# Altium schematic sheet Main.SchDoc
size A4; SheetNumber: 1; SheetTotal: 5
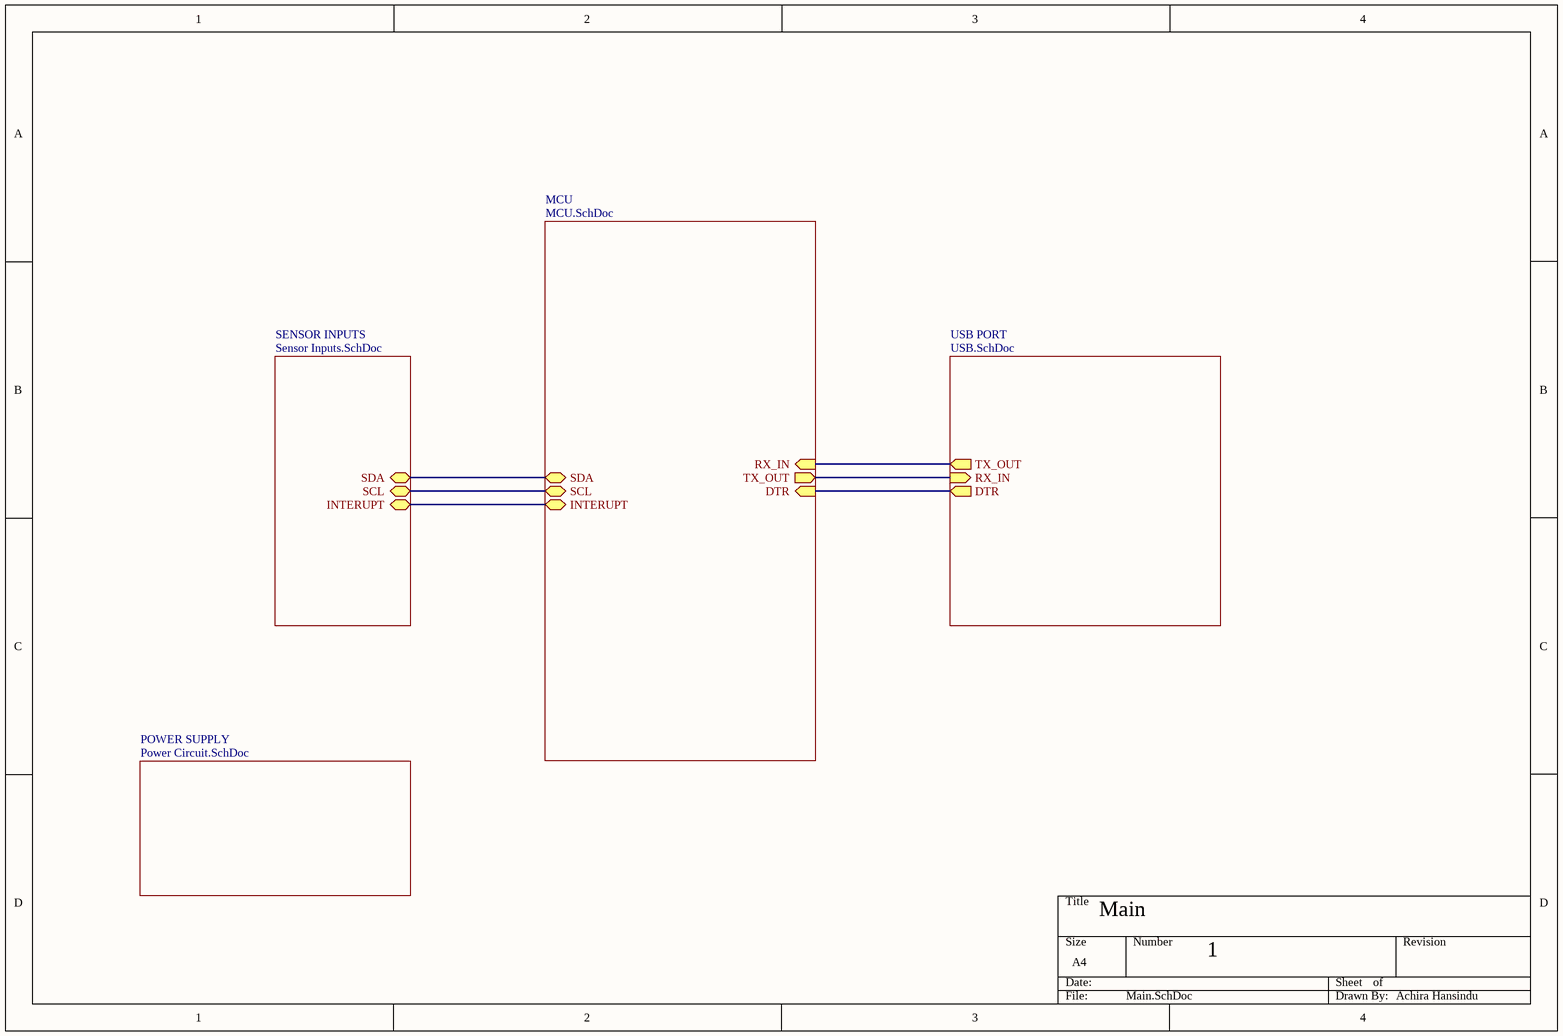
[diagram p0: Main.SchDoc]

## Sub-sheets
MCU = MCU.SchDoc: SDA (bidir), SCL (bidir), INTERUPT (bidir), RX_IN (in), TX_OUT (out), DTR (in)
POWER SUPPLY = Power Circuit.SchDoc: no entries
SENSOR INPUTS = Sensor Inputs.SchDoc: SDA (bidir), SCL (bidir), INTERUPT (bidir)
USB PORT = USB.SchDoc: TX_OUT (out), RX_IN (in), DTR (out)

## Nets
(unnamed): sheet MCU/SDA, sheet SENSOR INPUTS/SDA
(unnamed): sheet MCU/SCL, sheet SENSOR INPUTS/SCL
(unnamed): sheet MCU/INTERUPT, sheet SENSOR INPUTS/INTERUPT
(unnamed): sheet MCU/RX_IN, sheet USB PORT/TX_OUT
(unnamed): sheet MCU/TX_OUT, sheet USB PORT/RX_IN
(unnamed): sheet MCU/DTR, sheet USB PORT/DTR

## Notes on the sheet
- Main
- 1
- Achira Hansindu